# Altium schematic sheet OBC_V1.SchDoc
size A4; SheetNumber: 1; SheetTotal: 11
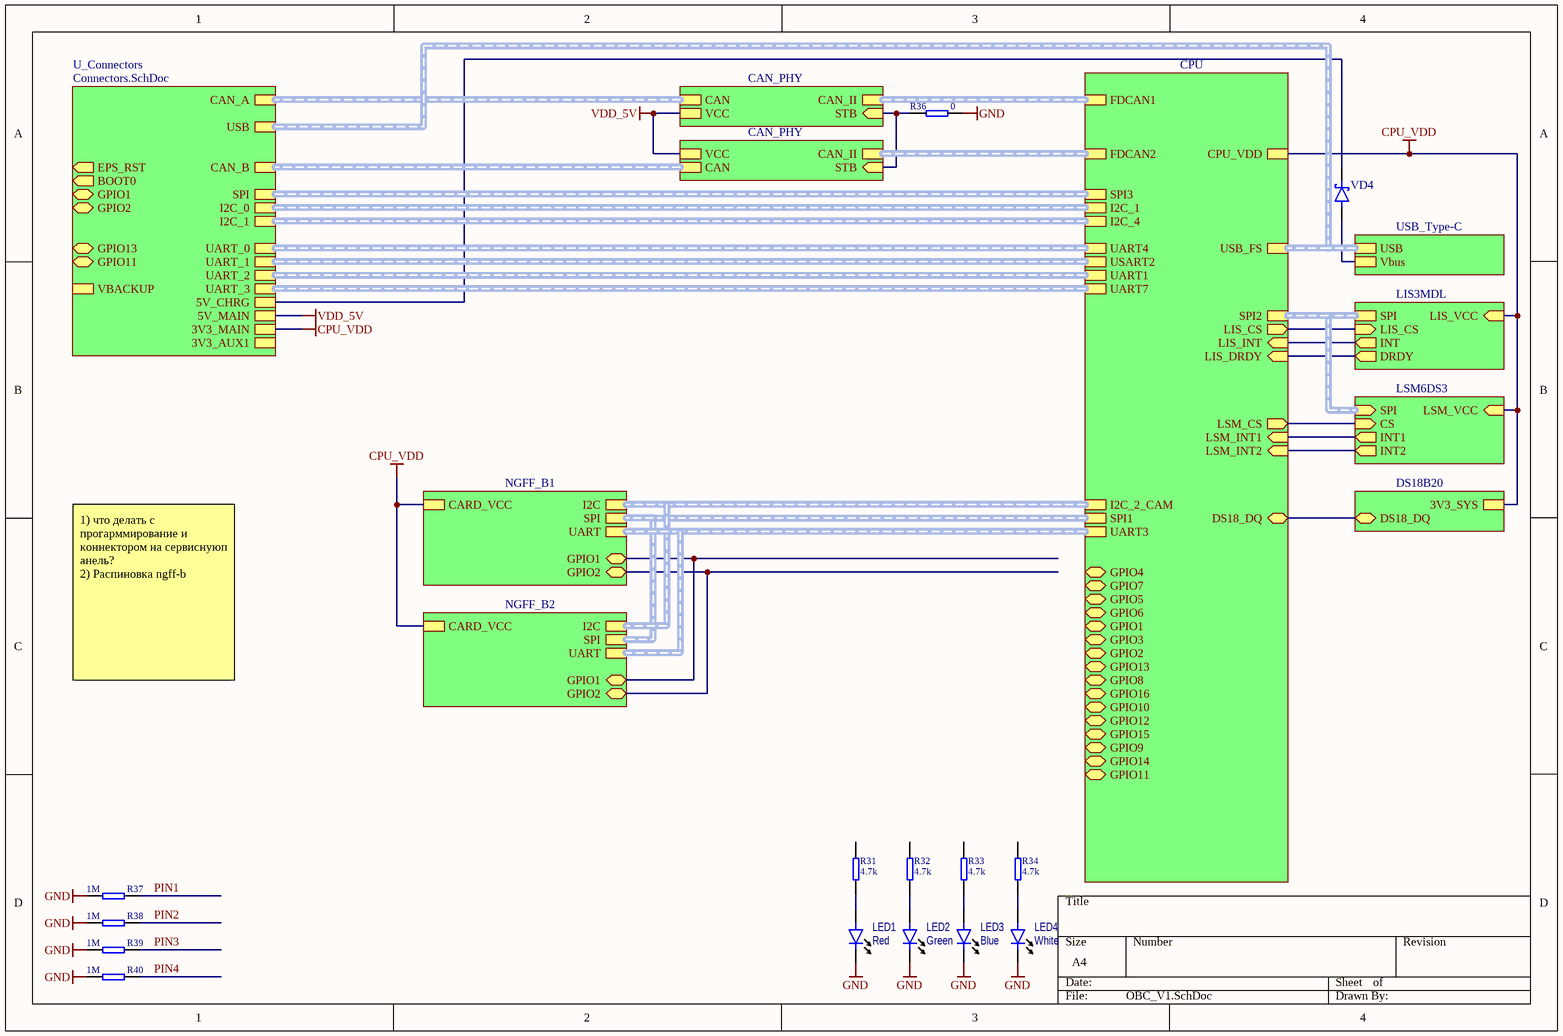
[diagram p0: OBC_V1.SchDoc]

## Parts
LED1  value Red  [LED 0805]
LED2  value Green  [LED 0805]
LED3  value Blue  [LED 0805]
LED4  value White  [LED 0805]
R31  value 4.7k  [RES 0603]
R32  value 4.7k  [RES 0603]
R33  value 4.7k  [RES 0603]
R34  value 4.7k  [RES 0603]
R36  value 0  [RES 0603]
R37  value 1M  [RES 0402]
R38  value 1M  [RES 0402]
R39  value 1M  [RES 0402]
R40  value 1M  [RES 0402]
VD4  (no value)  [SOD-123]

## Sub-sheets
CAN_PHY = CAN_PHY.SchDoc: VCC, STB (in), CAN (harness CAN), CAN_II (harness CAN_II)
CAN_PHY = CAN_PHY.SchDoc: VCC, STB (in), CAN (harness CAN), CAN_II (harness CAN_II)
CPU = CPU.SchDoc: SPI3 (harness SPI), I2C_2_CAM (harness I2C), I2C_1 (harness I2C), USB_FS (harness USB), SPI1 (harness SPI), I2C_4 (harness I2C), SPI2 (harness SPI), FDCAN1 (harness CAN_II), FDCAN2 (harness CAN_II), UART4 (harness UART), UART7 (harness UART), UART1 (harness UART), USART2 (harness UART), CPU_VDD, LIS_CS (out), LIS_INT (in), LIS_DRDY (in), LSM_CS (out), LSM_INT1 (in), LSM_INT2 (in), DS18_DQ (bidir), UART3 (harness UART), GPIO4 (bidir), GPIO7 (bidir), GPIO5 (bidir), GPIO6 (bidir), GPIO1 (bidir), GPIO3 (bidir), GPIO2 (bidir), GPIO13 (bidir), GPIO8 (bidir), GPIO16 (bidir), GPIO10 (bidir), GPIO12 (bidir), GPIO15 (bidir), GPIO9 (bidir), GPIO14 (bidir), GPIO11 (bidir)
DS18B20 = DS18B20.SchDoc: DS18_DQ (bidir), 3V3_SYS
LIS3MDL = LIS3MDL.SchDoc: LIS_VCC (in), SPI (harness SPI), DRDY (out), INT (out), LIS_CS (in)
LSM6DS3 = LSM6DS3.SchDoc: CS (in), LSM_VCC (in), SPI (in, harness SPI), INT1 (out), INT2 (out)
NGFF_B1 = NGFF_B.SchDoc: UART (harness UART), CARD_VCC, I2C (harness I2C), SPI (harness SPI), GPIO1 (bidir), GPIO2 (bidir)
NGFF_B2 = NGFF_B.SchDoc: UART (harness UART), CARD_VCC, I2C (harness I2C), SPI (harness SPI), GPIO1 (bidir), GPIO2 (bidir)
U_Connectors = Connectors.SchDoc: 3V3_MAIN, VBACKUP, CAN_A (harness CAN), CAN_B (harness CAN), I2C_0 (harness I2C), I2C_1 (harness I2C), 5V_CHRG, 3V3_AUX1, UART_1 (harness UART), UART_0 (harness UART), UART_2 (harness UART), UART_3 (harness UART), USB (harness USB), EPS_RST (out), BOOT0 (out), GPIO1 (bidir), GPIO2 (bidir), 5V_MAIN, SPI (harness SPI), GPIO13 (bidir), GPIO11 (bidir)
USB_Type-C = USB_Type-C.SchDoc: USB (harness USB), Vbus

## Nets
CPU_VDD: sheet U_Connectors/3V3_MAIN, sheet CPU/CPU_VDD, sheet LIS3MDL/LIS_VCC, sheet LSM6DS3/LSM_VCC, sheet DS18B20/3V3_SYS, sheet NGFF_B1/CARD_VCC, sheet NGFF_B2/CARD_VCC
GND: LED1.2(Cathode) LED2.2(Cathode) LED3.2(Cathode) LED4.2(Cathode) R36.2 R37.1 R38.1 R39.1 R40.1
VDD_5V: sheet U_Connectors/5V_MAIN, sheet CAN_PHY/VCC, sheet CAN_PHY/VCC
PIN1: R37.2
PIN2: R38.2
PIN3: R39.2
PIN4: R40.2
NetLED1_1: LED1.1(Anode) R31.1
NetLED2_1: LED2.1(Anode) R32.1
NetLED3_1: LED3.1(Anode) R33.1
NetLED4_1: LED4.1(Anode) R34.1
NetR36_1: R36.1 ; sheet CAN_PHY/STB, sheet CAN_PHY/STB
NetVD4_A: VD4.A(Anode) ; sheet USB_Type-C/Vbus
NetVD4_C: VD4.C(Cathode) ; sheet U_Connectors/5V_CHRG
(unnamed): sheet CPU/LIS_CS, sheet LIS3MDL/LIS_CS
(unnamed): sheet CPU/LIS_INT, sheet LIS3MDL/INT
(unnamed): sheet CPU/LIS_DRDY, sheet LIS3MDL/DRDY
(unnamed): sheet CPU/LSM_CS, sheet LSM6DS3/CS
(unnamed): sheet CPU/LSM_INT1, sheet LSM6DS3/INT1
(unnamed): sheet CPU/LSM_INT2, sheet LSM6DS3/INT2
(unnamed): sheet CPU/DS18_DQ, sheet DS18B20/DS18_DQ
(unnamed): sheet NGFF_B1/GPIO1, sheet NGFF_B2/GPIO1
(unnamed): sheet NGFF_B1/GPIO2, sheet NGFF_B2/GPIO2

Not connected (* = marked no-connect by the designer): R31 2(12); R32 2(12); R33 2(12); R34 2(12)

## Buses and harness runs
harness sheet CAN_PHY/CAN = sheet U_Connectors/CAN_A
harness sheet CAN_PHY/CAN = sheet U_Connectors/CAN_B
harness sheet CAN_PHY/CAN_II = sheet CPU/FDCAN1
harness sheet CAN_PHY/CAN_II = sheet CPU/FDCAN2
harness sheet CPU/I2C_1 = sheet U_Connectors/I2C_0
harness sheet CPU/I2C_2_CAM = sheet NGFF_B1/I2C = sheet NGFF_B2/I2C
harness sheet CPU/I2C_4 = sheet U_Connectors/I2C_1
harness sheet CPU/SPI1 = sheet NGFF_B1/SPI = sheet NGFF_B2/SPI
harness sheet CPU/SPI2 = sheet LIS3MDL/SPI = sheet LSM6DS3/SPI
harness sheet CPU/SPI3 = sheet U_Connectors/SPI
harness sheet CPU/UART1 = sheet U_Connectors/UART_2
harness sheet CPU/UART3 = sheet NGFF_B1/UART = sheet NGFF_B2/UART
harness sheet CPU/UART4 = sheet U_Connectors/UART_0
harness sheet CPU/UART7 = sheet U_Connectors/UART_3
harness sheet CPU/USART2 = sheet U_Connectors/UART_1
harness sheet CPU/USB_FS = sheet U_Connectors/USB = sheet USB_Type-C/USB

## Notes on the sheet
- 1) что делать с прогарммирование и коннектором на сервиснуюп анель?
  2) Распиновка ngff-b

## Library data of the parts
LED1-LED4 = LED: Light Emittering Diode; IsSMT: NoSMT
R31-R34 R36-R40 = !Resistor: Resistor; IsSMT: NoSMT
VD4 = DiodeS: Diode Shottky; IsSMT: NoSMT